# Altium project 6_DOF_Controller.PrjPcb
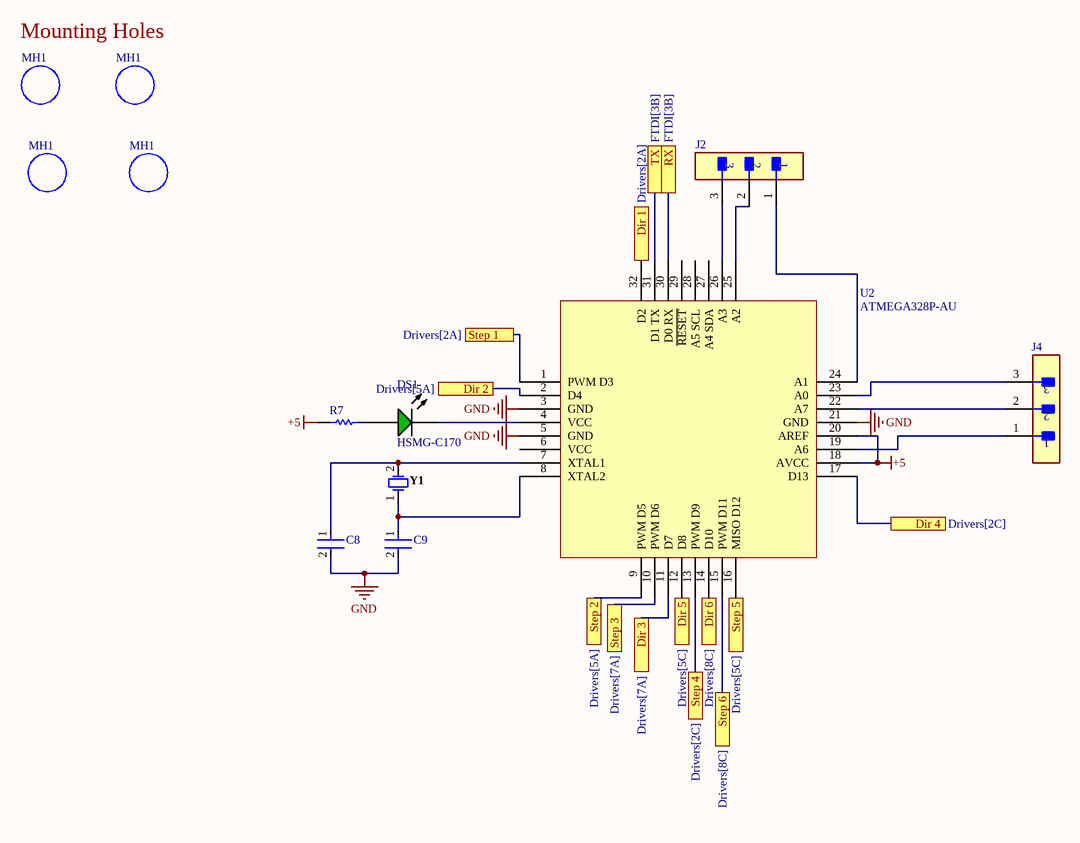
[diagram p0: Controller.SchDoc]
3 sheets, 42 parts. Net scope: flat (ports and power ports of the same name join across sheets).
Board file: PCB Layout.PcbDoc
Sheets:
  Controller.SchDoc
  Buck.SchDoc
  FTDI.SchDoc

## Sheet Controller.SchDoc
size A4; SheetNumber: 1; SheetTotal: 4

### Parts
(Parts that share a designator on the sheet are numbered #1, #2 ... from top to bottom, then left to right.)
C8  C0603C220J1GACTU  [FP-C0603C-CF-MFG]  (value not drawn)
C9  C0603C220J1GACTU  [FP-C0603C-CF-MFG]  (value not drawn)
DS1  HSMG-C170  [AVAG-HSMX-C170_V]
J2  NRPN031PAEN-RC  [FP-NRPN031PAEN-RC-MFG]  (value not drawn)
J4  NRPN031PAEN-RC  [FP-NRPN031PAEN-RC-MFG]  (value not drawn)
MH1#1  Mounting Hole_1  [Mounting Hole_1]  (value not drawn)
MH1#2  Mounting Hole_1  [Mounting Hole_1]  (value not drawn)
MH1#3  Mounting Hole_1  [Mounting Hole_1]  (value not drawn)
MH1#4  Mounting Hole_1  [Mounting Hole_1]  (value not drawn)
R7  CRCW0402220KFKED  [RESC1005X40X25LL05T05]  (value not drawn)
U2  ATMEGA328P-AU  [TQFP80P900X900X120-32N]
Y1  FOXSLF/160-20  [FOX-FOXSLF160-20]  (value not drawn)

### Ports
Dir 1 (see Drivers[2A]), Dir 2 (see Drivers[5A]), Dir 3 (see Drivers[7A]), Dir 4 (see Drivers[2C]), Dir 5 (see Drivers[5C]), Dir 6 (see Drivers[8C]), RX (see FTDI[3B]), Step 1 (see Drivers[2A]), Step 2 (see Drivers[5A]), Step 3 (see Drivers[7A]), Step 4 (see Drivers[2C]), Step 5 (see Drivers[5C]), Step 6 (see Drivers[8C]), TX (see FTDI[3B])

### Nets
+5: R7.1 U2.18(AVCC) U2.20(AREF)
GND: C8.2 C9.2 U2.3(GND) U2.5(GND) U2.21(GND)
NetC8_1: C8.1 U2.7(XTAL1) Y1.2
NetC9_1: C9.1 U2.8(XTAL2) Y1.1
NetDS1_1: DS1.1(A) R7.2
NetDS1_2: DS1.2(K) U2.4(VCC)
NetJ2_1: J2.1 U2.24(A1)
NetJ2_2: J2.2 U2.25(A2)
NetJ2_3: J2.3 U2.26(A3)
NetJ4_1: J4.1 U2.19(A6)
NetJ4_2: J4.2 U2.22(A7)
NetJ4_3: J4.3 U2.23(A0)
NetR1_2: U2.30(D0_RX) ; port RX
NetR2_2: U2.31(D1_TX) ; port TX
NetU2_1: U2.1(PWM_D3) ; port Step 1
NetU2_2: U2.2(D4) ; port Dir 2
NetU2_9: U2.9(PWM_D5) ; port Step 2
NetU2_10: U2.10(PWM_D6) ; port Step 3
NetU2_11: U2.11(D7) ; port Dir 3
NetU2_12: U2.12(D8) ; port Dir 5
NetU2_13: U2.13(PWM_D9) ; port Step 4
NetU2_14: U2.14(D10) ; port Dir 6
NetU2_15: U2.15(PWM_D11) ; port Step 6
NetU2_16: U2.16(MISO_D12) ; port Step 5
NetU2_17: U2.17(D13) ; port Dir 4
NetU2_32: U2.32(D2) ; port Dir 1

Not connected (* = marked no-connect by the designer): U2 6(VCC) 27(A4_SDA) 28(A5_SCL) 29(~{RESET})

### Notes on the sheet
- (near MH1#1) Mounting Holes

### Library data of the parts
C8 C9 = CMP-2006-03322-2: CAP CER 22PF 100V 5% NP0 0603; Manufacturer: KEMET; Material: Ceramic; Automotive Grade: Grade 1; Temperature Characteristic: C0G; Temperature Coefficient: 30ppm/°C; Tolerance: 0.05; Temperature Range High: +125°C; Capacitance: 22 pF; ComponentLink2URL: https://api.kemet.com/component-edge/download/datasheet/C0603C100J5GACAUTO.pdf; Package: C0603C-CF; Category: Cap; Voltage Rating: 100 V; Automotive: Yes; Mouser Description: Multilayer Ceramic Capacitors MLCC - SMD/SMT 100volts 22pF C0G 5%; Device Class L1: Passive Components; Device Class L3: Ceramic Capacitors; Temperature: -55°C to +125°C; Digikey Description: CAP CER 22PF 100V 5% NP0 0603; RoHS: TRUE; Value: 22 pF; ComponentLink2Description: Datasheet; Height: 0.87mm; Temperature Range Low: -55°C; Manufacturer Part Number: C0603C220J1GACTU; Device Class L2: Capacitors; Octopart: https://octopart.com/c0603c220j1gactu-kemet-9142653; Lead Free: Yes
DS1 = CMP-2000-05062-1: Chip LED, Green, 2.2 V, -40 to 85 degC, 2-Pin SMD, Pb-Free, Tape and Reel; Manufacturer: Avago; No. of Pins: 2; Peak Wavelength: 570nm; SVHC: NoSVHC(16-Jun-2014); Dominant Wavelength: 572nm; Forward Current If: 20mA; Viewing Angle: 170deg; Lens Shape: Rectangular; PIV Max: 5V; External Width: 1.25mm; LED Type: Standard; External Depth: 0.8mm; Opto Mounting Orientation: Top; Luminous Intensity: 15mcd; Luminous Intensity Min: 4mcd; Forward Voltage VF Max: 2.6V; External Length / Height: 2mm; Bulb Size: 1.25mmx1.4mm; Light Area Height: 1mm; Voltage Vf Typ: 2.2V; Operating Temperature Max: 85degC; Datasheet Version: Oct-08; MSL: MSL2A-4weeks; Peak Forward Current: 20mA; Package Description: 2-Pin Surface Mount Device, Body 2 x 1.25 mm, Height 0.8 mm; Datasheet URL: https://datasheet.ciiva.com/29280/180495-da-01-en-chip-led-hsmg-c170-gelb-gruen-29280971.pdf; Storage Temperature Min: -40degC; LED Colour: Green; Wavelength Typ: 570nm; Mounting Type: SMD; Forward Current If Max: 20mA; Dominant Wavelength Typ: 572nm; LED Mounting: SMD; Operating Temperature Range: -30degCto+85degC; Operating Temperature Min: -30degC; Manufacturer URL: http://www.avagotech.com/; Packaging: CutTape; Luminous Intensity Typ: 15mcd; Package Reference: HSMX-C170; Storage Temperature Max: 85degC; Opto Case Style: SMD; Forward Voltage: 2.2V
J2 J4 = CMP-25680-000021-1: CONN HEADER VERT 3POS 2MM; Manufacturer: Sullins; Number Of Contacts: 3; Conn Orientation: Straight; Voltage Rating: 150V; Conn Gender: Male; Current Rating: 2A; Temperature Range High: +105°C; Category: Conn; Manufacturer Part Number: NRPN031PAEN-RC; RoHS: TRUE; Contact Material: Gold,Nickel; ComponentLink2URL: https://drawings-pdf.s3.amazonaws.com/10531.pdf; Temperature: -40°C to +105°C; Lead Free: Yes; Octopart: https://octopart.com/nrpn031paen-rc-sullins-12817732; ComponentLink2Description: Datasheet; Pitch: 2mm; Number Of Rows: 1; Automotive: No; Height: 6mm; Device Class L2: Headers and Wire Housings; Digikey Description: CONN HEADER VERT 3POS 2MM; Package: 0; Device Class L3: unset; Temperature Range Low: -40°C; Device Class L1: Connectors
R7 = CMP-2002-08370-1: Manufacturer: Vishay Dale; Part Number: CRCW0402220KFKED
U2 = ATMEGA328P-AU: AVR AVR® ATmega Microcontroller IC 8-Bit 20MHz 32KB (16K x 16) FLASH 32-TQFP (7x7); ComponentLink1Description: Digi-Key; ComponentLink1URL: https://www.digikey.ca/en/products/detail/microchip-technology/ATMEGA328P-AU/1832260; Created By: Mostafa H; Date Created: 2023-08-19; Digi-Key Part Number: ATMEGA328P-AU-ND; ComponentLink2Description: Datasheet; ComponentLink2URL: https://ww1.microchip.com/downloads/aemDocuments/documents/MCU08/ProductDocuments/DataSheets/ATmega48A-PA-88A-PA-168A-PA-328-P-DS-DS40002061B.pdf
Y1 = CMP-1749-00003-1: Resistance Weld Thru-Hole Crystal, 16 MHz, -20 to 70 degC, 2-Pin THD, RoHS, Bulk; Voltage Rating: 250 V; Tolerance: 1%; Resistance: 221 kohm; Case\Package: Axial; Power Rating: 250 mW; RoHSCompliant: true; Package Quantity: 200; Packaging: Bulk; Min Operating Temperature: -55 degC; DatasheetVersion: Mar-15; ComponentLink1URL: http://www.foxonline.com/; Max Operating Temperature: 155 degC; PackageReference: FOXSLF160-20; Mount: Through Hole; PackageDescription: 2-Pin Through Hole Device, Body 11.35 x 4.65 mm; ComponentLink1Description: Manufacturer URL; ComponentLink2URL: http://www.foxonline.com/pdfs/hc49slf.pdf; ComponentLink2Description: Datasheet; Length: 0.248 inch

## Sheet Buck.SchDoc
size A4; SheetNumber: 2; SheetTotal: 4
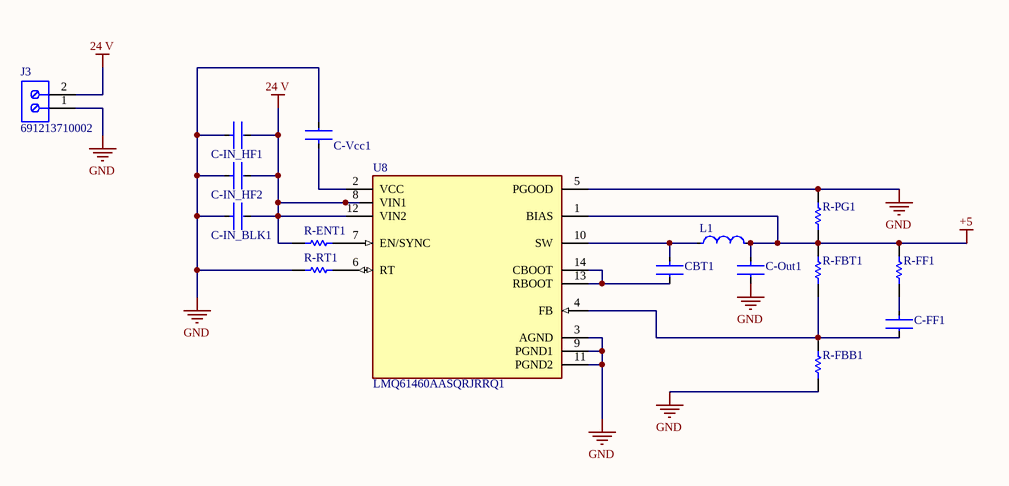
[diagram p1: Buck.SchDoc]

### Parts
C-FF1  GRM188R60J106ME47D  [FP-GRM188-0_1-e0_2_0_55-IPC_A]  (value not drawn)
C-IN_BLK1  GRM188R60J106ME47D  [FP-GRM188-0_1-e0_2_0_55-IPC_A]  (value not drawn)
C-IN_HF1  GRM188R60J106ME47D  [FP-GRM188-0_1-e0_2_0_55-IPC_A]  (value not drawn)
C-IN_HF2  GRM188R60J106ME47D  [FP-GRM188-0_1-e0_2_0_55-IPC_A]  (value not drawn)
C-Out1  GRM188R60J106ME47D  [FP-GRM188-0_1-e0_2_0_55-IPC_A]  (value not drawn)
C-Vcc1  GRM188R60J106ME47D  [FP-GRM188-0_1-e0_2_0_55-IPC_A]  (value not drawn)
CBT1  GRM188R60J106ME47D  [FP-GRM188-0_1-e0_2_0_55-IPC_A]  (value not drawn)
J3  691213710002  [691213710002]
L1  (no value)  [FP-B82422A-MFG]
R-ENT1  (no value)  [RESC1609X50X30NL8T20]
R-FBB1  (no value)  [RESC1609X50X30NL8T20]
R-FBT1  (no value)  [RESC1609X50X30NL8T20]
R-FF1  (no value)  [RESC1609X50X30NL8T20]
R-PG1  (no value)  [RESC1609X50X30NL8T20]
R-RT1  (no value)  [RESC1609X50X30NL8T20]
U8  LMQ61460AASQRJRRQ1  [FP-RJR0014A-MFG]

### Nets
24 V: C-IN_BLK1.2 C-IN_HF1.2 C-IN_HF2.2 J3.2 R-ENT1.1 U8.8(VIN1) U8.12(VIN2)
+5: C-Out1.1 L1.2 R-FBT1.2 R-FF1.2 R-PG1.1 U8.1(BIAS)
GND: C-IN_BLK1.1 C-IN_HF1.1 C-IN_HF2.1 C-Out1.2 C-Vcc1.2 J3.1 R-FBB1.1 R-PG1.2 R-RT1.1 U8.3(AGND) U8.5(PGOOD) U8.9(PGND1) U8.11(PGND2)
NetC-FF1_1: C-FF1.1 R-FF1.1
NetC-FF1_2: C-FF1.2 R-FBB1.2 R-FBT1.1 U8.4(FB)
NetC-Vcc1_1: C-Vcc1.1 U8.2(VCC)
NetCBT1_1: CBT1.1 L1.1 U8.10(SW)
NetCBT1_2: CBT1.2 U8.13(RBOOT) U8.14(CBOOT)
NetR-ENT1_2: R-ENT1.2 U8.7(EN/SYNC)
NetR-RT1_2: R-RT1.2 U8.6(RT)

### Library data of the parts
C-FF1 C-IN_BLK1 C-IN_HF1 C-IN_HF2 C-Out1 C-Vcc1 CBT1 = CMP-2006-02792-2: Chip Multilayer Ceramic Capacitors for General Purpose, 0603, 10uF, X5R, 15%, 20%, 6.3V; Packaging: Tape and Reel; Voltage Rating (DC): 6.3V; Width: 0.031inch; Termination: SMD/SMT; Dielectric: X5R; Package Quantity: 4000; Voltage Rating: 6.3V; Capacitance: 10uF; Case/Package: 0603; Min Operating Temperature: -55°C; Voltage: 6.3V; Length: 1.6mm; Thickness: 0.035inch; Lead Free: Lead Free; Depth: 0.8mm; Case Code (Imperial): 0603; Max Operating Temperature: 85°C; Material: Ceramic; Height: 0.8mm; Tolerance: 20%; Mount: Surface Mount; REACH SVHC: No SVHC; Radiation Hardening: No; Case Code (Metric): 1608
J3 = CMP-1502-02526-2: NexarPartId: 8917718; Number of Contacts: 2; Current Rating: 10A; Stripping Length: -7mm; Wire Gauge (Max): 26AWG; Plating: Brass, Steel; Wire Gauge (Min): 16AWG; Voltage: 300V; Number of Levels: 1; Pitch: 5.0038mm; Color: Green; Number of Pins: 2; Housing Material: Nylon; Termination: Screw; Max Operating Temperature: 105°C; Min Operating Temperature: -40°C; Packaging: Box; Current: 10A; REACH SVHC: Unknown; Width: 10.6mm; RoHS: Compliant; Mount: Through Hole; Height: 10mm; Contact Material: Brass; Length: 8.3mm; Lead Pitch: 5mm; Wire/Cable Gauge: 26AWG; Voltage Rating: 300V; Number of Positions Per Level: 2; Contact Plating: Tin
L1 = CMP-2000-05912-2: FIXED IND 10UH 180MA 1.6 OHM SMD; Tolerance: 10%; Core Material: Ferrite; Q Factor: 27; Self Resonant Frequency: 25MHz; Shielding: Unshielded; Test Frequency: 1MHz; Series Resistance: 1.6R; Radiation Hardening: No; REACH SVHC: No SVHC; Width: 0.098inch; RoHS Compliant: Yes; Case/Package: 1210; DC Current: 180mA; Package Quantity: 2000; Height - Seated (Max): 0.083inch; Rated Current-Max: 180mA; Series: SIMID; Mount: Surface Mount; Depth: 2.8mm; Resistor Type: Wirewound; Max DC Current: 180mA; Termination: SMD/SMT; Contact Plating: Tin; Height: 2.1mm; Inductance: 10uH; Case Code (Metric): 3225; Lead Free: Lead Free; Weight: 0.001764oz; Max Operating Temperature: 125°C; Length: 3.5mm; Packaging: Tape and Reel; Case Code (Imperial): 1210; Inductance Tolerance: 10%; Ratings: AEC-Q200; Number of Pins: 2; Current Rating: 180mA; Military Standard: Not; DC Resistance (DCR): 1.6R
R-ENT1 R-FBB1 R-FBT1 R-FF1 R-PG1 R-RT1 = CMP-2000-03816-5: Chip Resistor, 0 Ohm, Jumper, 100 mW, -55 to 155 degC, 0603 (1608 Metric), RoHS, Tape and Reel; Manufacturer: Vishay Semiconductor; Voltage Rating: 75 V; Package Quantity: 5000; DatasheetVersion: 06/2012; Min Operating Temperature: -55 degC; ComponentLink1URL: http://www.vishay.com/; Mounting Technology: Surface Mount; Height: 0.45 mm; ComponentLink1Description: Manufacturer URL; REACH SVHC: Unknown; PackageReference: 0603; Packaging: Tape and Reel; Max Operating Temperature: 155 degC; Mount: Surface Mount; ComponentLink2Description: Datasheet; PackageDescription: 2-Pin Surface Mount Device, Body 1.575 x 0.85 mm; Length: 1.55 mm; ComponentLink2URL: http://www.vishay.com/docs/20035/dcrcwe3.pdf; Pins: 2; RoHSCompliant: true
U8 = CMP-04918-000596-1: AUTOMOTIVE 3-V TO 36-V, 6-A LOW

## Sheet FTDI.SchDoc
size A4; SheetNumber: 4; SheetTotal: 4
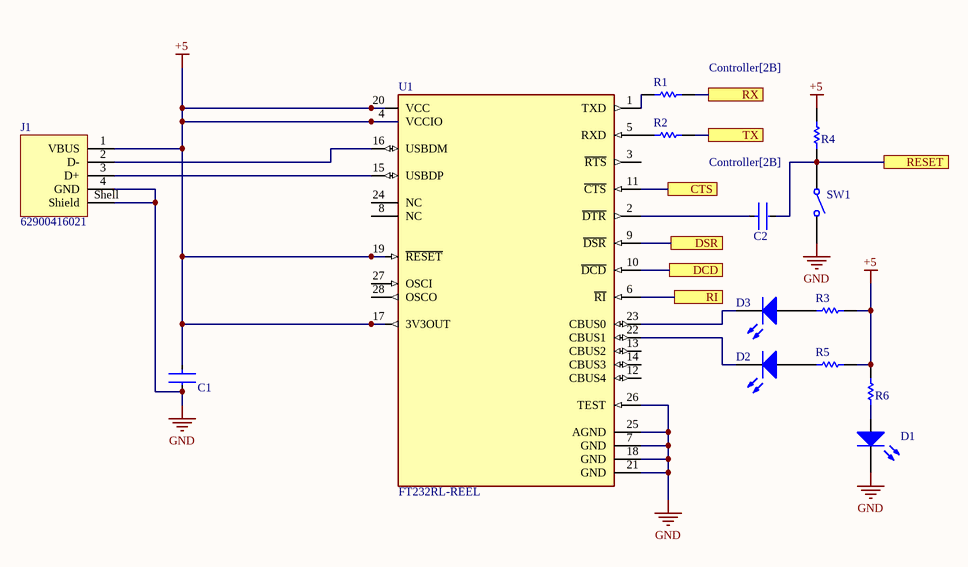
[diagram p2: FTDI.SchDoc]

### Parts
C1  GRM188R60J106ME47D  [FP-GRM188-0_1-e0_2_0_55-IPC_A]  (value not drawn)
C2  GRM188R60J106ME47D  [FP-GRM188-0_1-e0_2_0_55-IPC_A]  (value not drawn)
D1  Light-Emitting Diode  (value not drawn)
D2  Light-Emitting Diode  (value not drawn)
D3  Light-Emitting Diode  (value not drawn)
J1  62900416021  [62900416021]
R1  CRCW06030000Z0EA  [RESC1609X50X30NL8T20]  (value not drawn)
R2  CRCW06030000Z0EA  [RESC1609X50X30NL8T20]  (value not drawn)
R3  CRCW06030000Z0EA  [RESC1609X50X30NL8T20]  (value not drawn)
R4  CRCW06030000Z0EA  [RESC1609X50X30NL8T20]  (value not drawn)
R5  CRCW06030000Z0EA  [RESC1609X50X30NL8T20]  (value not drawn)
R6  CRCW06030000Z0EA  [RESC1609X50X30NL8T20]  (value not drawn)
SW1  FSMSMTR  [TECO-FSMSMTR_V]  (value not drawn)
U1  FT232RL-REEL  [FP-SSOP-28-MFG]

### Ports
CTS, DCD, DSR, RESET, RI, RX (see Controller[2B]), TX (see Controller[2B])

### Nets
+5: C1.1 J1.1(VBUS) R3.2 R4.2 R5.2 R6.2 U1.4(VCCIO) U1.17(3V3OUT) U1.19(~{RESET}) U1.20(VCC)
GND: C1.2 D1.2(K) J1.4(GND) J1.Shell(Shield) SW1.2 U1.7(GND) U1.18(GND) U1.21(GND) U1.25(AGND) U1.26(TEST)
NetC2_1: C2.1 U1.2(~{DTR})
NetC2_2: C2.2 R4.1 SW1.1 ; port RESET
NetD1_1: D1.1(A) R6.1
NetD2_1: D2.1(A) R5.1
NetD2_2: D2.2(K) U1.22(CBUS1)
NetD3_1: D3.1(A) R3.1
NetD3_2: D3.2(K) U1.23(CBUS0)
NetJ1_2: J1.2(D-) U1.16(USBDM)
NetJ1_3: J1.3(D+) U1.15(USBDP)
NetR1_1: R1.1 U1.1(TXD)
NetR1_2: R1.2 ; port RX
NetR2_1: R2.1 U1.5(RXD)
NetR2_2: R2.2 ; port TX
NetU1_6: U1.6(~{RI}) ; port RI
NetU1_9: U1.9(~{DSR}) ; port DSR
NetU1_10: U1.10(~{DCD}) ; port DCD
NetU1_11: U1.11(~{CTS}) ; port CTS

Not connected (* = marked no-connect by the designer): U1 3(~{RTS}) 8(NC) 12(CBUS4) 13(CBUS2) 14(CBUS3) 24(NC) 27(OSCI) 28(OSCO)

### Library data of the parts
C1 C2 = CMP-2006-02792-2: as C-FF1 on sheet Buck; Packaging: Tape and Reel; Voltage Rating (DC): 6.3V; Width: 0.031inch; Termination: SMD/SMT; Dielectric: X5R; Package Quantity: 4000; Voltage Rating: 6.3V; Capacitance: 10uF; Case/Package: 0603; Min Operating Temperature: -55°C; Voltage: 6.3V; Length: 1.6mm; Thickness: 0.035inch; Lead Free: Lead Free; Depth: 0.8mm; Case Code (Imperial): 0603; Max Operating Temperature: 85°C; Material: Ceramic; Height: 0.8mm; Tolerance: 20%; Mount: Surface Mount; REACH SVHC: No SVHC; Radiation Hardening: No; Case Code (Metric): 1608
D1-D3 = LED: AF: 1; BV: 0; BV_MAX: 1e99; EG: 1.11; FC: 0.5; IBV: 0.001; IS: 1e-14; MJSW: 0.33; NTUN: 30; TNOM: 27; XTI: 3; SimulationGenericComponent: True; CJO: 0; CJP: 0; CTA: 0; CTP: 0; FCS: 0.5; FV_MAX: 1e99; IKF: 0; IKR: 0; ISR: 1e-14; JSW: 0; JTUN: 0; JTUNSW: 0; KEG: 1; KF: 0; LEVEL: 1; N: 1; NBV: 1; NR: 1; NS: 1; PHP: 1; RS: 0; TCV: 0; TLEV: 0; TLEVC: 0; TM1: 0; TM2: 0; TPB: 0; TPHP: 0; TRS: 0; TRS2: 0; TT: 0; TTT1: 0; TTT2: 0; VJ: 1; XTITUN: 3
J1 = CMP-1502-03240-2: NexarPartId: 19991170; Number of Contacts: 4; Insulation Resistance: 1GΩ; Connector Type: USB; Contact Resistance: 20mΩ; Gender: Receptacle; Current Rating: 1.5A; Operating Supply Voltage: 30V; USB Standard: USB 2.0; Packaging: Cut Tape; Contact Plating: Gold; REACH SVHC: Unknown; Orientation: Horizontal; RoHS: Compliant; Features: Shielded; Length: 14.4mm; Max Operating Temperature: 105°C; Number of Pins: 4; Termination: SMD/SMT; Lead Free: Lead Free; Min Operating Temperature: -40°C; Mount: Horizontal, Surface Mount
R1-R6 = CMP-2000-03816-5: as R-ENT1 on sheet Buck; Package Quantity: 5000; DatasheetVersion: 06/2012; Min Operating Temperature: -55 degC; ComponentLink1URL: http://www.vishay.com/; Mounting Technology: Surface Mount; Height: 0.45 mm; ComponentLink1Description: Manufacturer URL; REACH SVHC: Unknown; PackageReference: 0603; Packaging: Tape and Reel; Max Operating Temperature: 155 degC; Mount: Surface Mount; ComponentLink2Description: Datasheet; PackageDescription: 2-Pin Surface Mount Device, Body 1.575 x 0.85 mm; Length: 1.55 mm; ComponentLink2URL: http://www.vishay.com/docs/20035/dcrcwe3.pdf; Pins: 2; RoHSCompliant: true
SW1 = CMP-2000-07501-1: FSMSM Push Button Switch, 50 mA, -35 to 85 degC, 2-Pin SMD, RoHS, Tape and Reel; Manufacturer: TE Connectivity; Voltage Rating (DC): 24V; Electrical Life: 20000Cycles; Operating Force: 180gf; Switch Travel: 0.25mm; Contact Current Rating: 50mA; Case\/Package: SMD/SMT; Actuator Length: 1.07mm; Throw Configuration: SPST; Actuator Material: Polyamide; Contact Resistance: 100mOhm; Illumination Type: Illuminated; Max Voltage Rating (DC): 12V; Manufacturer URL: http://www.te.com/; Lead Free: LeadFree; Packaging: TapeandReel; Min Operating Temperature: -35degC; Mechanical Life: 20000Cycles; Mount: SurfaceMount; REACH SVHC: Unknown; Package Quantity: 1800; Package Reference: FSMSMTR; RoHSCompliant: true; Max Operating Temperature: 85degC; Orientation: Straight; ELV: Compliant; Datasheet URL: http://www.te.com/commerce/DocumentDelivery/DDEController?Action=showdoc&DocId=Customer+Drawing%7F1437566-3%7FC2%7Fpdf%7FEnglish%7FENG_CD_1437566-3_C2_1437566_3_1_c.dwg.pdf%7F1437566-4; Package Description: 2-Pin Surface Mount Device, Body 6 x 3.5 mm, Pitch 9.19 mm; Current Rating: 50mA; Contact Plating: Silver; Termination: GullWing; Datasheet Version: Rev. C2, 08/2014; Contact Material: Brass; Mounting Technology: SurfaceMount
U1 = CMP-0078-00029-4: IC USB FS SERIAL UART 28-SSOP; Data Rate: 12Mbps; Max Supply Voltage: 5.25V; Operating Supply Current: 15mA; Number of Channels: 1; Voltage: 5V; Min Supply Voltage: 3.3V; Radiation Hardening: No; Mount: Surface Mount; Min Operating Temperature: -40°C; Package Quantity: 2000; Number of Transceivers: 1; Width: 5.3mm; Number of Pins: 28; Height: 1.75mm; Weight: 0.080001oz; Lead Free: Lead Free; Length: 10.2mm; REACH SVHC: No SVHC; Max Operating Temperature: 85°C; Packaging: Tape and Reel; Interface: UART; Case/Package: SSOP

## Nets that join several sheets
+5: Controller (R7.1 U2.18 U2.20), Buck (6 pins), FTDI (10 pins)
GND: Controller (5 pins), Buck (13 pins), FTDI (10 pins)
NetR1_2: Controller (U2.30), FTDI (R1.2)
NetR2_2: Controller (U2.31), FTDI (R2.2)